# Altium schematic sheet Pi Sensor Board.SchDoc
size A2; SheetNumber: 3; SheetTotal: 3
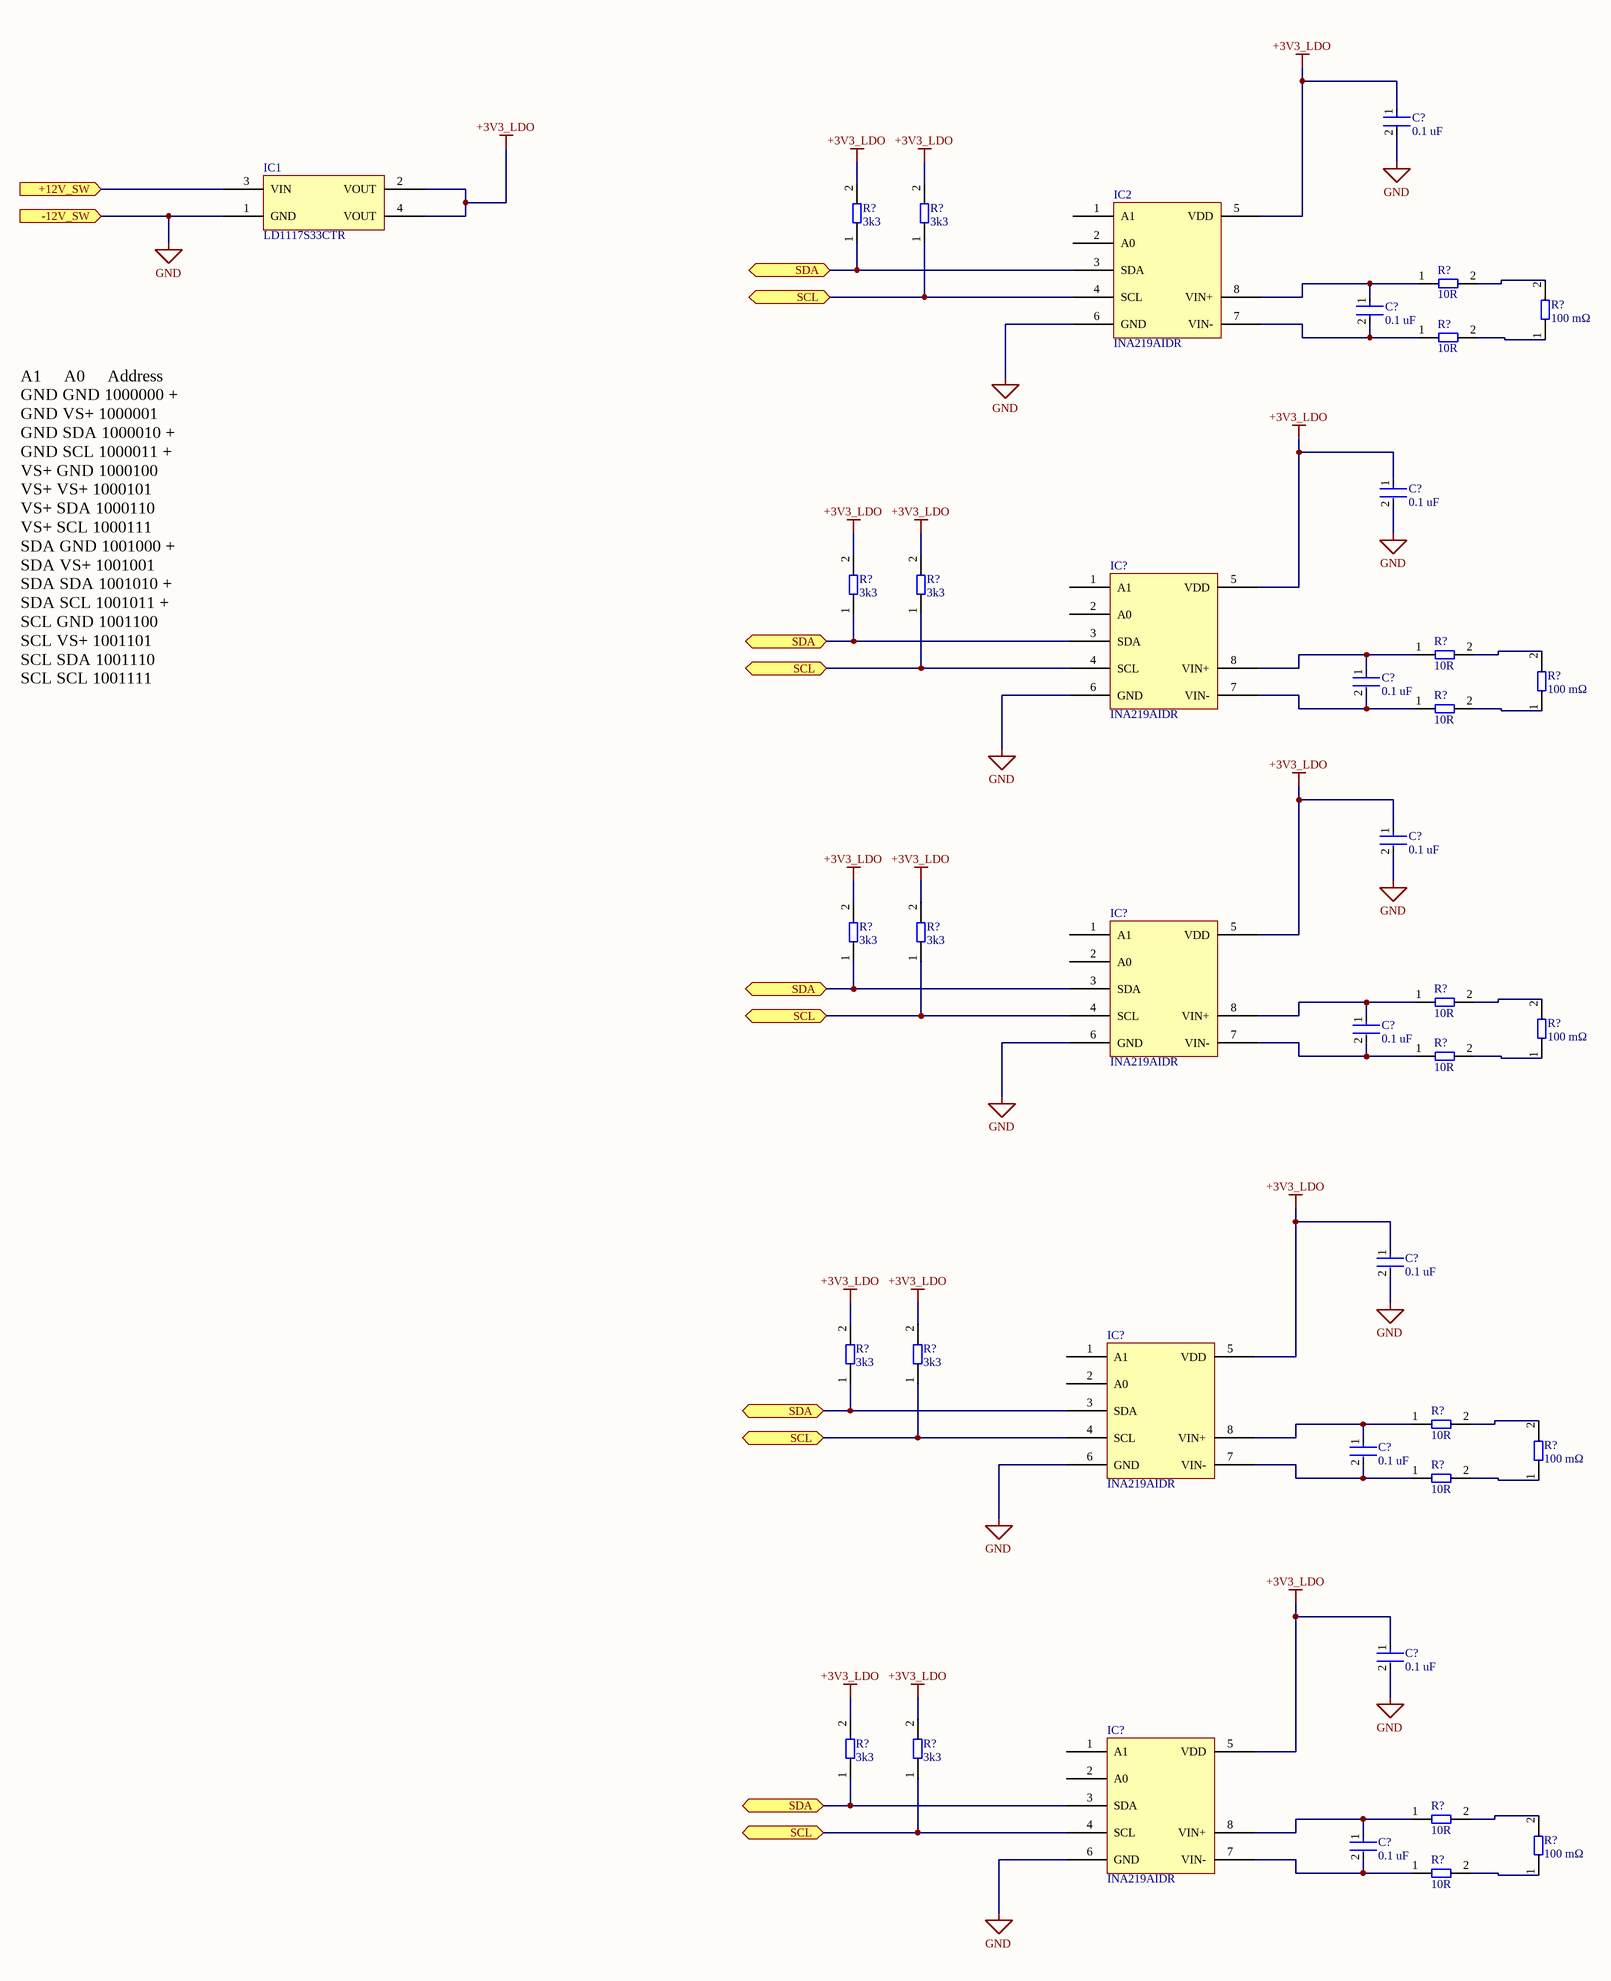
[diagram p0: Pi Sensor Board.SchDoc]

## Parts
(Parts that share a designator on the sheet are numbered #1, #2 ... from top to bottom, then left to right.)
C?#1  0.1 uF  [FP-C0805C-DN-MFG]
C?#2  0.1 uF  [FP-C0805C-DN-MFG]
C?#3  0.1 uF  [FP-C0805C-DN-MFG]
C?#4  0.1 uF  [FP-C0805C-DN-MFG]
C?#5  0.1 uF  [FP-C0805C-DN-MFG]
C?#6  0.1 uF  [FP-C0805C-DN-MFG]
C?#7  0.1 uF  [FP-C0805C-DN-MFG]
C?#8  0.1 uF  [FP-C0805C-DN-MFG]
C?#9  0.1 uF  [FP-C0805C-DN-MFG]
C?#10  0.1 uF  [FP-C0805C-DN-MFG]
IC1  LD1117S33CTR  [LD1117]
IC2  INA219AIDR  [INA219AIDR]
IC?#1  INA219AIDR  [INA219AIDR]
IC?#2  INA219AIDR  [INA219AIDR]
IC?#3  INA219AIDR  [INA219AIDR]
IC?#4  INA219AIDR  [INA219AIDR]
R?#1  3k3  [0805 Resistor - IPC A]
R?#2  3k3  [0805 Resistor - IPC A]
R?#3  10R  [0805 Resistor - IPC A]
R?#4  100 mΩ  [PE2512FKM070R1L]
R?#5  10R  [0805 Resistor - IPC A]
R?#6  3k3  [0805 Resistor - IPC A]
R?#7  3k3  [0805 Resistor - IPC A]
R?#8  10R  [0805 Resistor - IPC A]
R?#9  100 mΩ  [PE2512FKM070R1L]
R?#10  10R  [0805 Resistor - IPC A]
R?#11  3k3  [0805 Resistor - IPC A]
R?#12  3k3  [0805 Resistor - IPC A]
R?#13  10R  [0805 Resistor - IPC A]
R?#14  100 mΩ  [PE2512FKM070R1L]
R?#15  10R  [0805 Resistor - IPC A]
R?#16  3k3  [0805 Resistor - IPC A]
R?#17  3k3  [0805 Resistor - IPC A]
R?#18  10R  [0805 Resistor - IPC A]
R?#19  100 mΩ  [PE2512FKM070R1L]
R?#20  10R  [0805 Resistor - IPC A]
R?#21  3k3  [0805 Resistor - IPC A]
R?#22  3k3  [0805 Resistor - IPC A]
R?#23  10R  [0805 Resistor - IPC A]
R?#24  100 mΩ  [PE2512FKM070R1L]
R?#25  10R  [0805 Resistor - IPC A]

## Ports
+12V_SW (in, see Callisto Control Board[2B], 12V SMPS[8B]), -12V_SW (in, see Callisto Control Board[2B], 12V SMPS[8C]), SCL (bidir, see Callisto Control Board[3B]), SDA (bidir, see Callisto Control Board[3B])

## Nets
+3V3_LDO: C?#1.1 C?#3.1 C?#5.1 C?#7.1 C?#9.1 IC1.2(VOUT) IC1.4(VOUT) IC2.5(VDD) IC?#1.5(VDD) IC?#2.5(VDD) IC?#3.5(VDD) IC?#4.5(VDD) R?#1.2 R?#2.2 R?#6.2 R?#7.2 R?#11.2 R?#12.2 R?#16.2 R?#17.2 R?#21.2 R?#22.2
GND: C?#1.2 C?#3.2 C?#5.2 C?#7.2 C?#9.2 IC1.1(GND) IC2.6(GND) IC?#1.6(GND) IC?#2.6(GND) IC?#3.6(GND) IC?#4.6(GND) ; port -12V_SW
+12V_SW: IC1.3(VIN) ; port +12V_SW
SCL: IC2.4(SCL) IC?#1.4(SCL) IC?#2.4(SCL) IC?#3.4(SCL) IC?#4.4(SCL) R?#2.1 R?#7.1 R?#12.1 R?#17.1 R?#22.1 ; port SCL
SDA: IC2.3(SDA) IC?#1.3(SDA) IC?#2.3(SDA) IC?#3.3(SDA) IC?#4.3(SDA) R?#1.1 R?#6.1 R?#11.1 R?#16.1 R?#21.1 ; port SDA
NetC?#2_1: C?#2.1 IC2.8(VIN+) R?#3.1
NetC?#2_2: C?#2.2 IC2.7(VIN-) R?#5.1
NetC?#4_1: C?#4.1 IC?#1.8(VIN+) R?#8.1
NetC?#4_2: C?#4.2 IC?#1.7(VIN-) R?#10.1
NetC?#6_1: C?#6.1 IC?#2.8(VIN+) R?#13.1
NetC?#6_2: C?#6.2 IC?#2.7(VIN-) R?#15.1
NetC?#8_1: C?#8.1 IC?#3.8(VIN+) R?#18.1
NetC?#8_2: C?#8.2 IC?#3.7(VIN-) R?#20.1
NetC?#10_1: C?#10.1 IC?#4.8(VIN+) R?#23.1
NetC?#10_2: C?#10.2 IC?#4.7(VIN-) R?#25.1
NetR?#3_2: R?#3.2 R?#4.2
NetR?#4_1: R?#4.1 R?#5.2
NetR?#8_2: R?#8.2 R?#9.2
NetR?#9_1: R?#9.1 R?#10.2
NetR?#13_2: R?#13.2 R?#14.2
NetR?#14_1: R?#14.1 R?#15.2
NetR?#18_2: R?#18.2 R?#19.2
NetR?#19_1: R?#19.1 R?#20.2
NetR?#23_2: R?#23.2 R?#24.2
NetR?#24_1: R?#24.1 R?#25.2

Not connected (* = marked no-connect by the designer): IC2 1(A1) 2(A0); IC?#1 1(A1) 2(A0); IC?#2 1(A1) 2(A0); IC?#3 1(A1) 2(A0); IC?#4 1(A1) 2(A0)

## Notes on the sheet
- A1     A0     Address
  GND GND 1000000 +
  GND VS+ 1000001
  GND SDA 1000010 +
  GND SCL 1000011 +
  VS+ GND 1000100
  VS+ VS+ 1000101
  VS+ SDA 1000110
  VS+ SCL 1000111
  SDA GND 1001000 +
  SDA VS+ 1001001
  SDA SDA 1001010 +
  SDA SCL 1001011 +
  SCL GND 1001100
  SCL VS+ 1001101
  SCL SDA 1001110
  SCL SCL 1001111

## Library data of the parts
C?#1-C?#10 = CMP-03020-002581-2: C0805 0.10 μF X7R 30ppm/°C 20.00% 50 V C0805C104M5RAC; Manufacturer: KEMET; Capacitance: 0.10 μF; Voltage Rating: 50 V; Value: 0.10 μF; Tolerance: 0.2; Material: Ceramic; Category: Cap; Temperature: -55°C to +125°C; Lead Free: Yes; Device Class L3: Ceramic Capacitors; Package: C0805C-DN; Height: 0.88mm; Temperature Range High: +125°C; Device Class L2: Capacitors; Manufacturer Part Number: C0805C104M5RAC; Device Class L1: Passive Components; Temperature Coefficient: 30ppm/°C; ComponentLink2Description: Datasheet; RoHS: TRUE; Temperature Range Low: -55°C; ComponentLink2URL: https://content.kemet.com/datasheets/KEM_C1003_C0G_SMD.pdf; Temperature Characteristic: X7R; Mouser Description: Multilayer Ceramic Capacitors MLCC - SMD/SMT 50volts 0.1uF 20% X7R; Octopart: https://octopart.com/c0805c104m5rac-kemet-2226142; Ipc Land Pattern Name: CAPC200125X78; Automotive: No
IC1 = LD1117S33CTR: IC REG LINEAR 3.3V 800MA SOT223
IC2 IC?#1-IC?#4 = INA219AIDR: Current & Power Monitors & Regulators Zero-Drift,Bi-Dir Crnt/Pwr Monitor
R?#1 R?#2 R?#6 R?#7 R?#11 R?#12 R?#16 R?#17 R?#21 R?#22 = RE0805FRE073K3L: Thick Film Resistors - SMD 3.3 kOhms 125 mW 0805 1%
R?#3 R?#5 R?#8 R?#10 R?#13 R?#15 R?#18 R?#20 R?#23 R?#25 = RC0805FR-0710RL: Thick Film Resistors - SMD 10 Ohms 125 mW 0805 1%
R?#4 R?#9 R?#14 R?#19 R?#24 = PE2512FKM070R1L: Current Sense Resistors - SMD 100 mOhms 1 Watt 1 % 75 ppm/C AEC-Q200